# EAGLE design SparkFun_Teensy_Adapter (EAGLE 9.4.2)
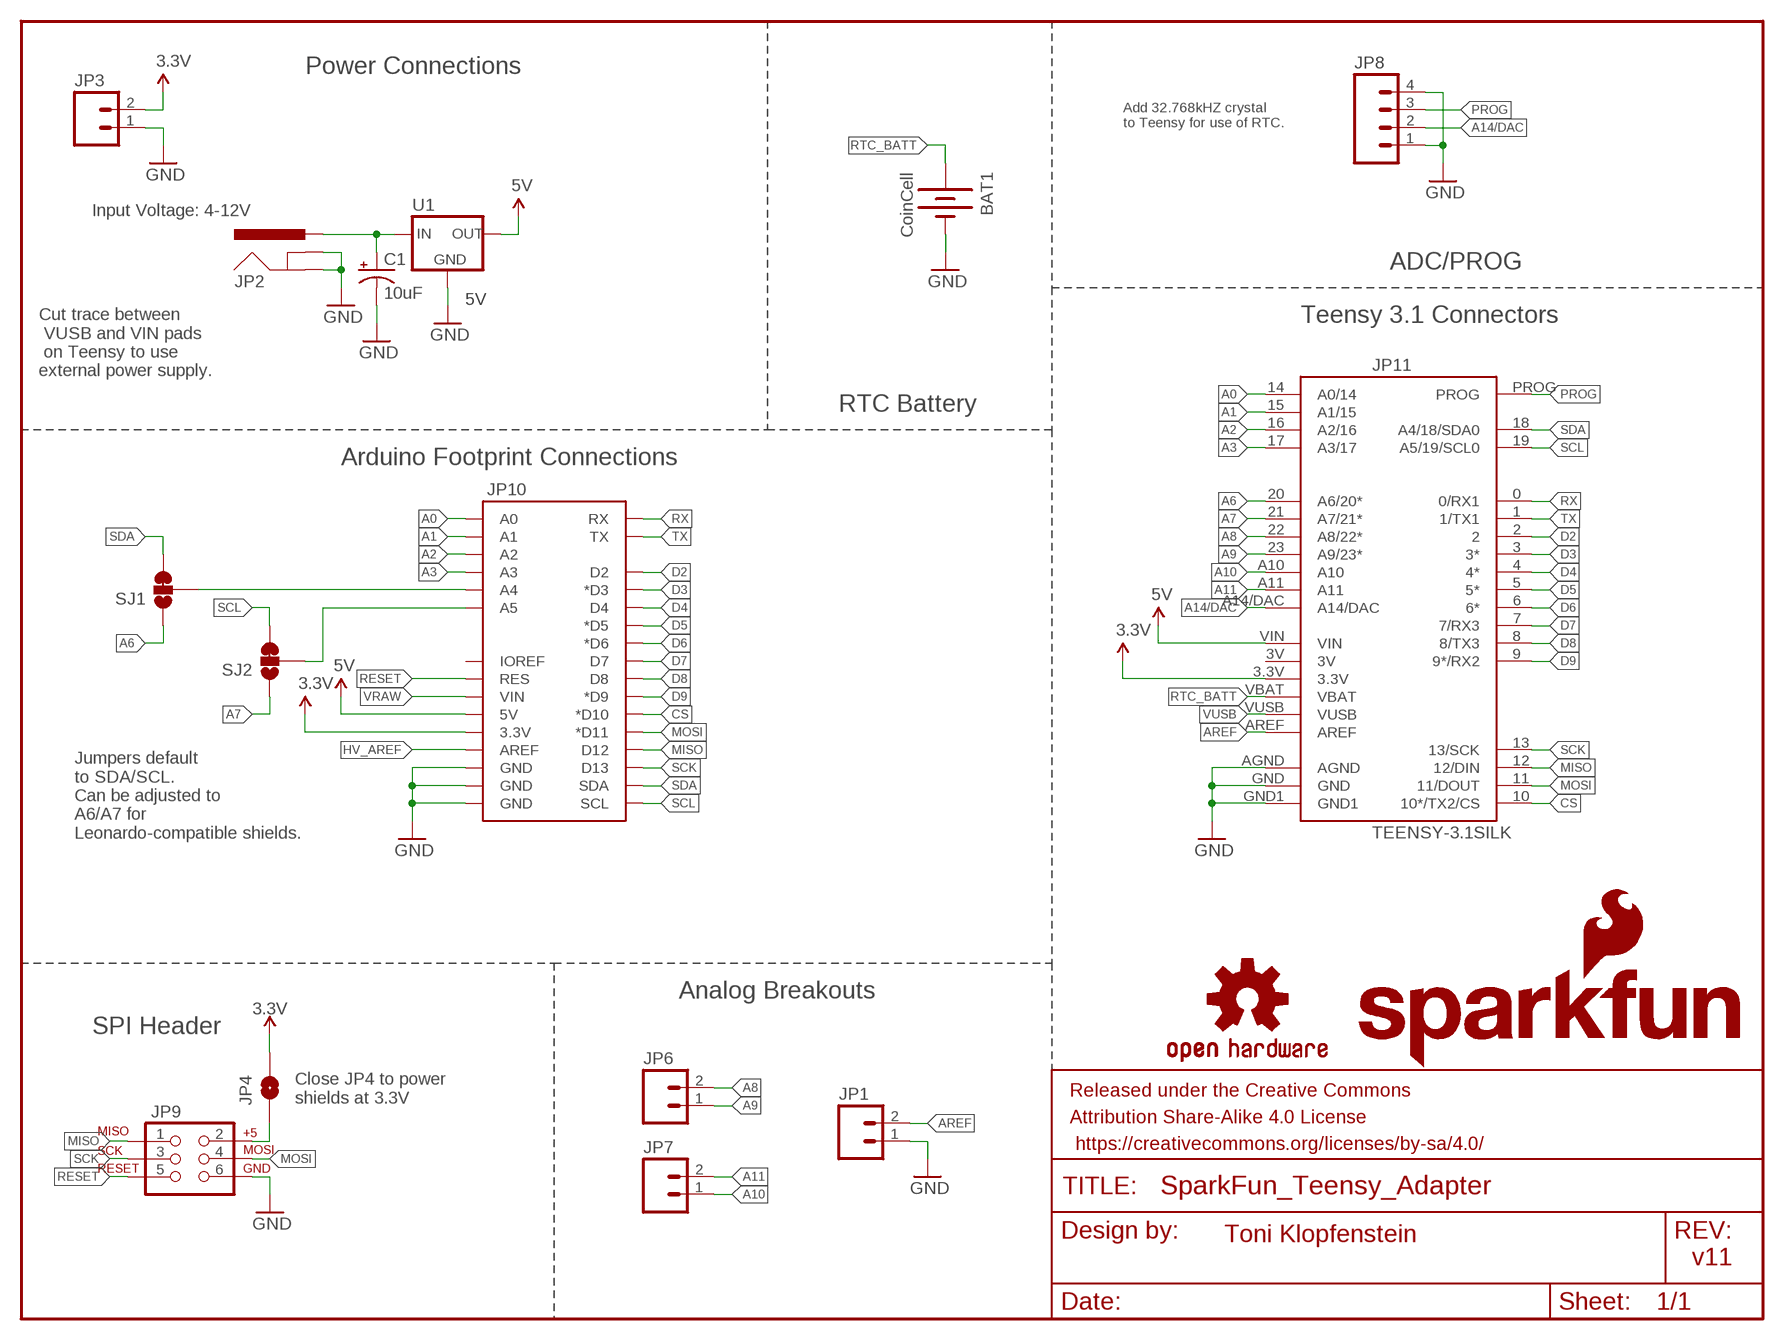
[diagram p0: schematic, sheet 1]

## Parts
BAT1  CoinCell  BATTERY12PTH  [BATTCON_12MM_PTH]
C1  10uF  10UF-25V-20%(PTH)  [CPOL-RADIAL-10UF-25V]
FRAME1  FRAME-LETTER  [CREATIVE_COMMONS]
JP1  M02PTH  [1X02]
JP2  POWER_JACKPTH_LOCK  [POWER_JACK_PTH_LOCK]
JP3  JST2  M02JST-PTH-2  [JST-2-PTH]
JP4  JUMPER-SMT_2_NO_SILK  [SMT-JUMPER_2_NO_SILK]
JP6  M02PTH  [1X02]
JP7  M02PTH  [1X02]
JP8  M04PTH  [1X04]
JP9  AVR_SPI_PRG_6PTH  [2X3]
JP10  ARDUINO_R3_SHIELDUNO_R3_SHIELD_HOLES  [UNO_R3_SHIELD_HOLES]
JP11  TEENSY-3.1SILK  [TEENSY-3.1]
LOGO1  SFE_LOGO_NAME_FLAME.1_INCH  [SFE_LOGO_NAME_FLAME_.1]
LOGO2  OSHW-LOGOM  [OSHW-LOGO-M]
SJ1  JUMPER-PAD-3-2OF3_NC_BY_TRACE_SMALL  [PAD-JUMPER-3-2OF3_NC_BY_TRACE_YES_SILK_FULL_BOX]
SJ2  JUMPER-PAD-3-2OF3_NC_BY_TRACE_SMALL  [PAD-JUMPER-3-2OF3_NC_BY_TRACE_YES_SILK_FULL_BOX]
U1  5V  V_REG_78XX-TO-220  [TO-220-ALT]

## Nets
3.3V: JP3.2 JP4.2 JP10.3.3V JP11.3.3V
5V: JP10.5V JP11.VIN U1.OUT
A0: JP10.A0 JP11.14(A0/14)
A1: JP10.A1 JP11.15(A1/15)
A2: JP10.A2 JP11.16(A2/16)
A3: JP10.A3 JP11.17(A3/17)
A4: JP10.A4 SJ1.2
A5: JP10.A5 SJ2.2
A6: JP11.20(A6/20*) SJ1.1
A7: JP11.21(A7/21*) SJ2.1
A8: JP6.2 JP11.22(A8/22*)
A9: JP6.1 JP11.23(A9/23*)
A10: JP7.1 JP11.A10
A11: JP7.2 JP11.A11
A14/DAC: JP8.2 JP11.A14/DAC
AREF: JP1.2 JP11.AREF
CS: JP10.D10(*D10) JP11.10(10*/TX2/CS)
D2: JP10.D2 JP11.2
D3: JP10.D3(*D3) JP11.3(3*)
D4: JP10.D4 JP11.4(4*)
D5: JP10.D5(*D5) JP11.5(5*)
D6: JP10.D6(*D6) JP11.6(6*)
D7: JP10.D7 JP11.7(7/RX3)
D8: JP10.D8 JP11.8(8/TX3)
D9: JP10.D9(*D9) JP11.9(9*/RX2)
GND: BAT1.GND(-) C1.2(-) JP1.1 JP2.GND JP2.GNDBREAK JP3.1 JP8.1 JP8.4 JP9.6 JP10.GND@0(GND) JP10.GND@1(GND) JP10.GND@2(GND) JP11.AGND JP11.GND JP11.GND1 U1.GND
HV_AREF: JP10.AREF
MISO: JP9.1 JP10.D12 JP11.12(12/DIN)
MOSI: JP9.4 JP10.D11(*D11) JP11.11(11/DOUT)
N$1: JP4.1 JP9.2
PROG: JP8.3 JP11.PROG
RESET: JP9.5 JP10.RES
RTC_BATT: BAT1.VCC@1(+) JP11.VBAT
RX: JP10.RX JP11.0(0/RX1)
SCK: JP9.3 JP10.D13 JP11.13(13/SCK)
SCL: JP10.SCL JP11.19(A5/19/SCL0) SJ2.3
SDA: JP10.SDA JP11.18(A4/18/SDA0) SJ1.3
TX: JP10.TX JP11.1(1/TX1)
VRAW: C1.1(+) JP2.PWR JP10.VIN U1.IN
VUSB: JP11.VUSB
Unconnected: JP10.IOREF JP11.3V

## Notes on the sheet
- Power Connections
- Add 32.768kHZ crystal 
  to Teensy for use of RTC.
- Input Voltage: 4-12V
- ADC/PROG
- Teensy 3.1 Connectors
- Cut trace between
   VUSB and VIN pads
   on Teensy to use 
  external power supply.
- RTC Battery
- Arduino Footprint Connections
- Jumpers default
  to SDA/SCL.
  Can be adjusted to 
  A6/A7 for
  Leonardo-compatible shields.
- Analog Breakouts
- SPI Header
- Close JP4 to power
  shields at 3.3V
- Toni Klopfenstein
- v11

## Library data of the parts
BAT1 = SparkFun-Electromechanical:BATTERY: Battery Holders Various common sizes : AA, AAA, 18650 (PRT-12895), 20mm coin cell and 12mm coin cell. 20MM_4LEGS, BATT-10373; PROD_ID: BATT-08315
C1 = SparkFun-Capacitors:10UF-25V-20%(PTH): CAP-08440; PROD_ID: CAP-08440
FRAME1 = SparkFun-Aesthetics:FRAME-LETTER: Schematic Frame - Letter Standard 8.5x11 US Letter frame
JP1 JP6 JP7 = SparkFun-Connectors:M02: Standard 2-pin 0.1" header. Use with - straight break away headers ( PRT-00116) - right angle break away headers (PRT-00553) - swiss pins (PRT-00743) - machine pins (PRT-00117) - female headers (PRT-00115) Molex polarized connector foot print use with: PRT-08233 with associated crimp pins and housings. 2.54_SCREWTERM for use with PRT-10571. 3.5mm Screw Terminal footprints for PRT-08084 5mm Screw Terminal footprints for use with PRT-08432
JP2 = SparkFun-Connectors:POWER_JACK: Power Jack This is the standard 5.5mm barrel jack for power. The PTH is the most common, proven, reliable, footprint. The Slot footprint only works if the mill layer is transmitted to the PCB fab house so be warned. Mating wall wart : TOL-00298 (and others); PROD_ID: CONN-08197; SF_ID: PRT-00119
JP3 = SparkFun-Connectors:M02: Standard 2-pin 0.1" header. Use with - straight break away headers ( PRT-00116) - right angle break away headers (PRT-00553) - swiss pins (PRT-00743) - machine pins (PRT-00117) - female headers (PRT-00115) Molex polarized connector foot print use with: PRT-08233 with associated crimp pins and housings. 2.54_SCREWTERM for use with PRT-10571. 3.5mm Screw Terminal footprints for PRT-08084 5mm Screw Terminal footprints for use with PRT-08432; PROD_ID: CONN-09863; SKU: PRT-09914
JP4 = SparkFun-Jumpers:JUMPER-SMT_2_NO: Normally open jumper This jumper has two pads in close proximity to each other. Apply solder to close the connection. Round pads are easier to solder for beginners, but are a lot larger. SparkFun Product that uses the round pads: SparkFun EL Sequencer <https://www.sparkfun.com/products/12781>
JP8 = SparkFun-Connectors:M04: Header 4 Standard 4-pin 0.1" header. Use with straight break away headers (SKU : PRT-00116), right angle break away headers (PRT-00553), swiss pins (PRT-00743), machine pins (PRT-00117), and female headers (PRT-00115). Molex polarized connector foot print use with SKU : PRT-08231 with associated crimp pins and housings. 1MM SMD Version SKU: PRT-10208
JP9 = SparkFun-Connectors:AVR_SPI_PRG_6: AVR ISP 6 Pin This is the reduced ISP connector for AVR programming. Common on Arduino. This footprint will take up less PCB space and can be used with a 10-pin to 6-pin adapter such as SKU: BOB-08508 **Special note about "TEST_POINT" package. The stop mask is on the top side, so if you want your programming test points to be on the bottom of your board, make sure to place this package on the bottom side of the board. This also ensure that the orientation to program from the bottom side will be correct.
JP10 = Testing:ARDUINO_R3_SHIELD: Shield form compatible with the Arduino Uno R3.
JP11 = Testing:TEENSY-3.1; SF_ID: DEV-12646
LOGO1 = SparkFun-Aesthetics:SFE_LOGO_NAME_FLAME: SFE Logo, name and flame This is the SparkFun full logo. The logo on the schematic will always be the same size; the package variant is the height of the flame part of the logo. Default layer for the logo on the board is tSilk.
LOGO2 = SparkFun-Aesthetics:OSHW-LOGO: Open Source Hardware Logo This logo indicates the piece of hardware it is found on incorporates a OSHW license and/or adheres to the definition of open source hardware found here: http://freedomdefined.org/OSHW
SJ1 SJ2 = SparkFun-Passives:JUMPER-PAD-3-2OF3_NC_BY_TRACE
U1 = SparkFun-PowerIC:V_REG_78XX: Voltage Regulator Standard 78xx regulator. IGO (Input Ground Output). Spark Fun Electronics SKU : COM-00107; PROD_ID: VREG-08450; SF_ID: COM-00107

## Board
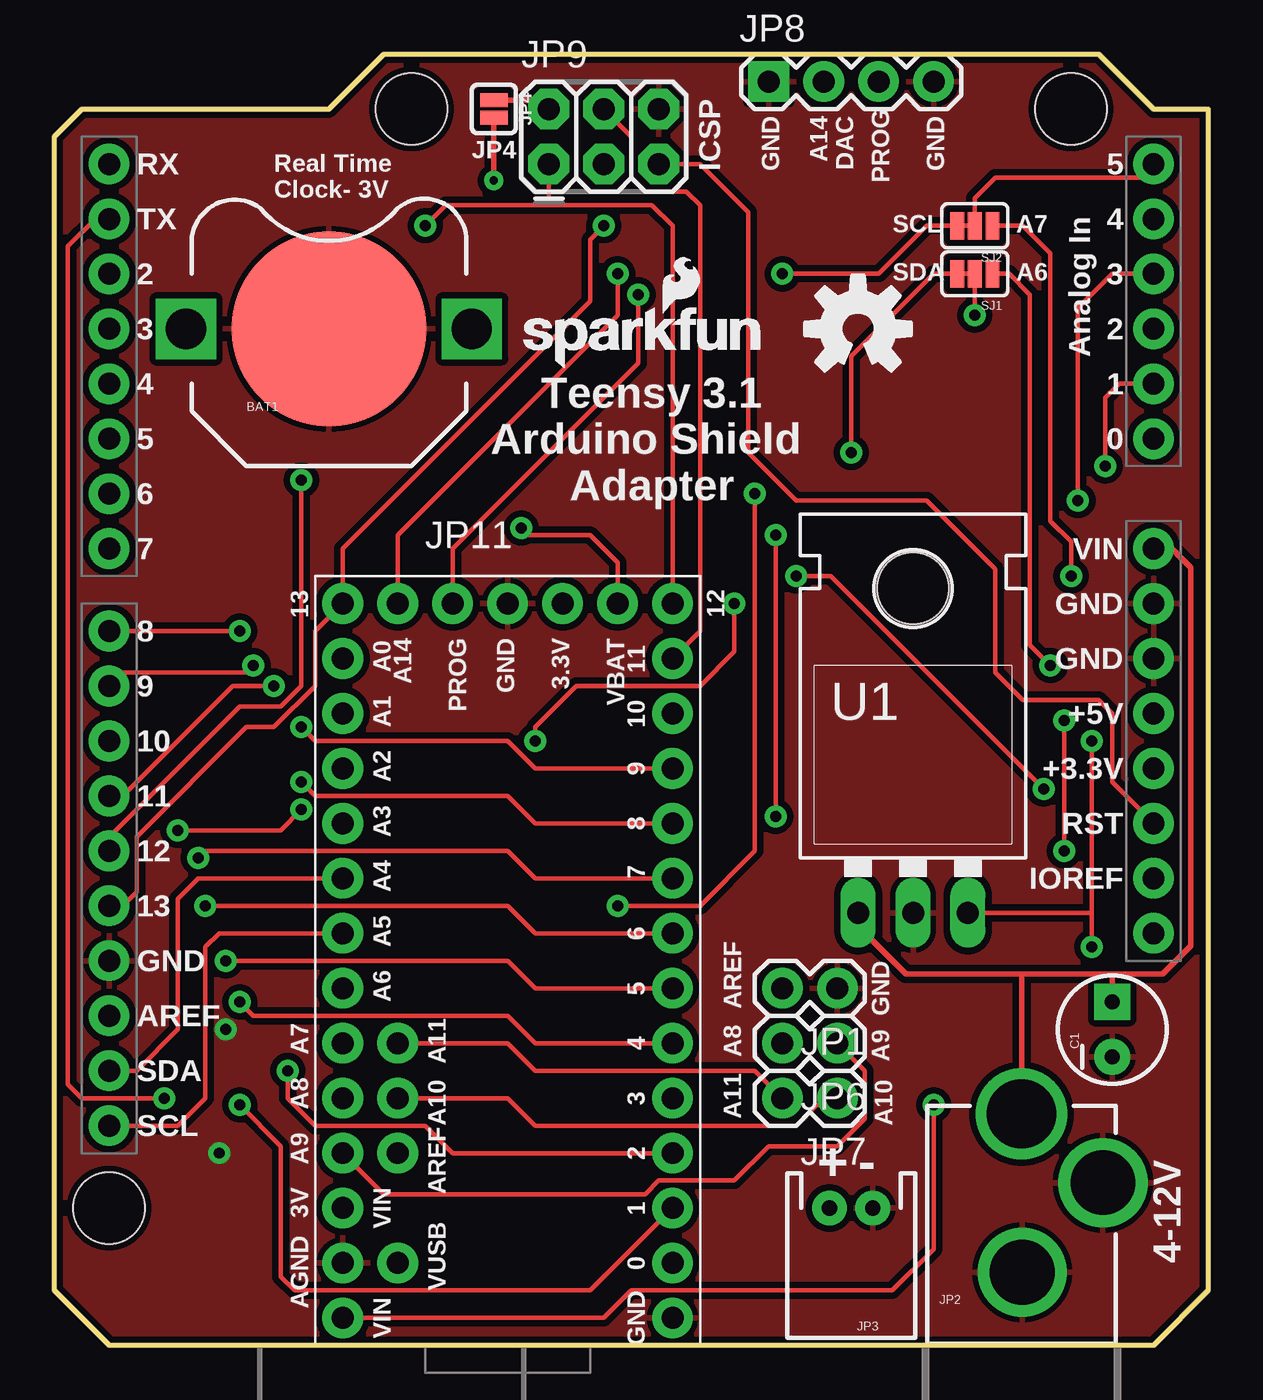
[diagram p1: board, top side]
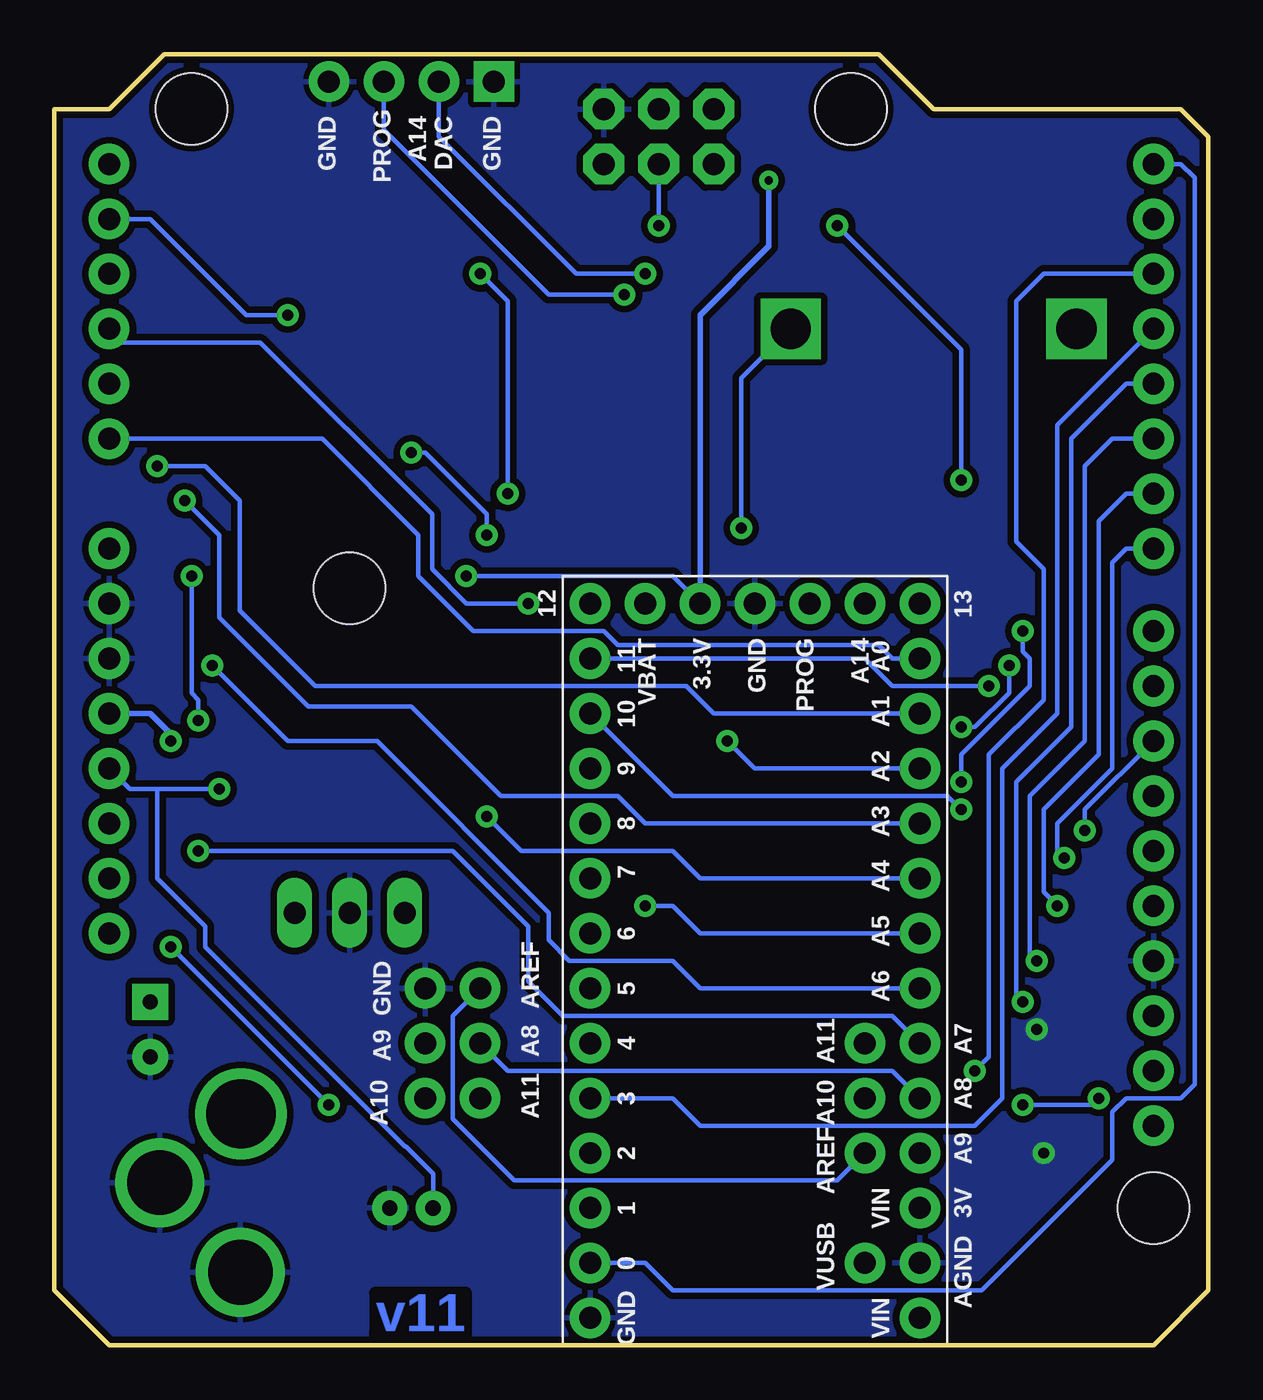
[diagram p2: board, bottom side, seen from below]

Size 53.34 x 59.69 mm. Coordinates in mm from the lower left corner, seen from the top.
Outline: 0,2.54 2.54,0 50.8,0 53.34,2.54 53.34,57.15 50.8,57.15 48.26,59.69 15.24,59.69 12.7,57.15 1.27,57.15 0,55.88 0,2.54
Copper layers (1*16): Top 0.035mm / dielectric 1.5mm / Bottom 0.035mm
Design rules "SparkFun-2-layer": minimum track width 7mil, minimum drill 15mil, track to track 8mil, track to pad 8mil, pad to pad 8mil, via to via 8mil, smd to smd 8mil, copper to edge 8mil, drill to drill 8mil, minimum pad ring 12mil, minimum via ring 10mil, stop-mask expansion 4mil, vias tented up to drill 20mil, thermal gap 10mil

### Footprints (pad centres in the part's own frame; a part is rotated, then mirrored left to right if it is on the bottom)
BATTCON_12MM_PTH = smd 9 x 9: GND 0,0 | drill 1.854 square: VCC@1 6.604,0; VCC@2 -6.604,0
CPOL-RADIAL-10UF-25V = drill 0.7 pad 1.651 square: 1 1.27,0 | drill 0.7 pad 1.651: 2 -1.27,0
1X02 = drill 1.016 pad 1.88: 1 0,0; 2 2.54,0
POWER_JACK_PTH_LOCK = drill 2.997 pad 4.115: GND 0.025,6.557; GNDBREAK 3.762,10.7 | drill 3.2 pad 4.115: PWR 0,13.878
JST-2-PTH = drill 0.7 pad 1.6: 1 -1,0; 2 1,0
SMT-JUMPER_2_NO_SILK = smd 0.635 x 1.27: 1 -0.406,0; 2 0.406,0
1X04 = drill 1.016 pad 1.88 square: 1 0,0 | drill 1.016 pad 1.88: 2 2.54,0; 3 5.08,0; 4 7.62,0
2X3 = drill 1.016 pad 1.88 octagon: 1 0,0; 2 0,2.54; 3 2.54,0; 4 2.54,2.54; 5 5.08,0; 6 5.08,2.54
UNO_R3_SHIELD_HOLES = drill 1.016 pad 1.88: 3.3V 50.8,26.67; 5V 50.8,29.21; A0 50.8,41.91; A1 50.8,44.45; A2 50.8,46.99; A3 50.8,49.53; A4 50.8,52.07; A5 50.8,54.61; AREF 2.54,15.24; D2 2.54,49.53; D3 2.54,46.99; D4 2.54,44.45; D5 2.54,41.91; D6 2.54,39.37; D7 2.54,36.83; D8 2.54,33.02; D9 2.54,30.48; D10 2.54,27.94; D11 2.54,25.4; D12 2.54,22.86; D13 2.54,20.32; GND@0 50.8,31.75; GND@1 50.8,34.29; GND@2 2.54,17.78; IOREF 50.8,21.59; NC 50.8,19.05; RES 50.8,24.13; RX 2.54,54.61; SCL 2.54,10.16; SDA 2.54,12.7; TX 2.54,52.07; VIN 50.8,36.83 | hole 3.302: 2.54,6.35; 46.99,57.15; 16.51,57.15
TEENSY-3.1 = drill 1.016 pad 1.88: 0 16.51,3.81; 1 16.51,6.35; 2 16.51,8.89; 3 16.51,11.43; 3.3V 11.43,34.29; 3V 1.27,6.35; 4 16.51,13.97; 5 16.51,16.51; 6 16.51,19.05; 7 16.51,21.59; 8 16.51,24.13; 9 16.51,26.67; 10 16.51,29.21; 11 16.51,31.75; 12 16.51,34.29; 13 1.27,34.29; 14 1.27,31.75; 15 1.27,29.21; 16 1.27,26.67; 17 1.27,24.13; 18 1.27,21.59; 19 1.27,19.05; 20 1.27,16.51; 21 1.27,13.97; 22 1.27,11.43; 23 1.27,8.89; A10 3.81,11.43; A11 3.81,13.97; A14/DAC 3.81,34.29; AGND 1.27,3.81; AREF 3.81,8.89; GND 8.89,34.29; GND1 16.51,1.27; PROG 6.35,34.29; VBAT 13.97,34.29; VIN 1.27,1.27; VUSB 3.81,3.81
PAD-JUMPER-3-2OF3_NC_BY_TRACE_YES_SILK_FULL_BOX = smd 0.635 x 1.27: 1 -0.813,0; 2 0,0; 3 0.813,0
TO-220-ALT = drill 1.016 long: GND 0,-3.81; IN -2.54,-3.81; OUT 2.54,-3.81 | hole 3.302: 0,11.176

### Placement (x,y rotation side)
BAT1  12.7,46.99 0 top
C1  48.9,14.6 90 top
FRAME1  16.51,-26.67 0 top  (outside the outline)
JP1  36.2,16.51 180 top
JP2  44.7,-3.18 0 top
JP3  36.83,6.35 180 top
JP4  20.32,57.15 270 top
JP6  36.2,13.97 180 top
JP7  36.2,11.43 180 top
JP8  33.02,58.42 0 top
JP9  22.86,54.61 0 top
JP10  0,0 0 top
JP11  12.07,0 0 top
LOGO1  21.27,45.08 0 top
LOGO2  37.15,46.99 0 top
SJ1  42.55,49.53 180 top
SJ2  42.55,51.75 180 top
U1  39.69,23.81 0 top

### Tracks (layer width: path | path; a pad name or v marks a point on that pad's centre or on a via)
3.3V  (via drill 0.38, 0.51)
  Top 0.203: v34.29,35.56 35.88,35.56 v45.72,25.72
  Top 0.254: v20.32,53.85 JP4.2
  Bottom 0.203: JP3.2 35.83,7.94 37.1,9.21 37.15,9.21 46.36,18.41 46.36,19.37 48.58,21.59 48.58,25.72 | JP11.3.3V 24.77,35.56 v34.29,35.56 | v45.72,25.72 48.58,25.72 | 48.58,25.72 49.85,25.72 JP10.3.3V
  Bottom 0.254: JP11.3.3V 23.5,47.62 20.32,50.8 v20.32,53.85
5V  (via drill 0.51)
  Top 0.203: JP11.VIN 25.4,1.27 26.67,2.54 38.73,2.54 40.64,4.44 v40.64,11.11 | 47.94,20 v47.94,27.94 | U1.OUT 47.94,20 | v47.94,18.41 47.94,20
  Bottom 0.203: v40.64,11.11 v47.94,18.41
  Bottom 0.254: v47.94,27.94 47.94,28.26 48.9,29.21 JP10.5V
A0
  Bottom 0.203: JP11.14 14.61,31.75 15.24,32.39 27.3,32.39 27.94,33.02 33.97,33.02 36.51,35.56 36.51,37.47 40.96,41.91 JP10.A0
A1  (via drill 0.51)
  Top 0.203: v48.58,40.64 48.58,43.81 49.21,44.45 JP10.A1
  Bottom 0.203: JP11.15 22.86,29.21 24.13,30.48 41.27,30.48 44.77,33.97 44.77,39.05 46.36,40.64 v48.58,40.64
A2  (via drill 0.51)
  Top 0.203: v22.23,27.94 22.23,28.57 24.13,30.48 29.84,30.48 31.43,32.07 v31.43,34.29
  Bottom 0.203: JP11.16 20.96,26.67 v22.23,27.94 | v31.43,34.29 34.29,34.29 35.88,35.88 35.88,38.42 43.81,46.36 50.16,46.36 JP10.A2
A3  (via drill 0.51)
  Top 0.203: JP10.A3 48.9,49.53 47.31,47.94 v47.31,39.05
  Bottom 0.203: JP11.17 26.04,24.13 27.3,25.4 32.7,25.4 36.83,29.53 41.59,29.53 45.72,33.66 45.72,37.47 v47.31,39.05
A4  (via drill 0.51)
  Top 0.203: SJ1.2 v42.55,47.62
  Bottom 0.203: JP10.A4 48.9,52.07 44.45,47.62 v42.55,47.62
A5
  Top 0.203: SJ2.2 42.55,53.02 43.5,53.97 50.16,53.97 JP10.A5
A6  (via drill 0.51)
  Top 0.203: SJ1.1 44.13,49.53 45.09,48.58 45.09,32.39 v46.04,31.43
  Bottom 0.203: JP11.20 23.5,16.51 24.77,17.78 29.53,17.78 30.48,18.73 30.48,20 38.42,27.94 42.55,27.94 v46.04,31.43
A7  (via drill 0.51)
  Top 0.203: SJ2.1 44.77,51.75 46.04,50.48 46.04,38.1 46.99,37.15 v46.99,35.56 | v46.67,22.86 v46.67,28.89
  Bottom 0.203: JP11.21 14.61,15.24 29.84,15.24 31.43,16.83 31.43,19.37 34.93,22.86 v46.67,22.86 | v46.99,35.56 46.99,30.16 46.67,29.84 v46.67,28.89
A8
  Bottom 0.203: JP11.22 14.61,12.7 32.38,12.7 JP6.2
A9
  Top 0.203: JP11.23 15.24,6.98 27.3,6.98 27.94,7.62 31.43,7.62 33.02,9.21 36.2,9.21 37.47,10.48 37.47,12.7 JP6.1
A10
  Top 0.203: JP11.A10 20.96,11.43 22.23,10.16 34.29,10.16 35.24,11.11 35.88,11.11 JP7.1
A11
  Top 0.203: JP11.A11 20.96,13.97 22.23,12.7 32.38,12.7 JP7.2
A14/DAC  (via drill 0.51)
  Top 0.203: JP11.A14/DAC 15.88,37.47 26.04,47.62 v26.04,49.53
  Bottom 0.203: v26.04,49.53 29.21,49.53 35.56,55.88 JP8.2
AREF
  Bottom 0.203: JP1.2 34.93,15.24 34.93,10.48 32.07,7.62 17.14,7.62 JP11.AREF
CS  (via drill 0.51)
  Top 0.203: v5.72,23.81 10.48,23.81 v11.43,24.76
  Bottom 0.203: v11.43,24.76 12.07,25.4 24.77,25.4 JP11.10 | JP10.D10 5.72,24.76 v5.72,23.81
D2  (via drill 0.51)
  Top 0.203: JP11.2 18.41,8.89 17.14,10.16 12.07,10.16 10.8,11.43 v10.8,12.7
  Bottom 0.203: v10.8,12.7 10.16,13.33 10.16,27.3 7.62,29.84 7.62,35.88 8.89,37.15 8.89,48.26 7.62,49.53 JP10.D2
D3
  Bottom 0.203: JP11.3 24.77,11.43 23.5,10.16 10.8,10.16 9.52,11.43 9.52,26.67 6.99,29.21 6.99,42.55 JP10.D3
D4  (via drill 0.51)
  Top 0.203: JP11.4 22.23,13.97 20.96,15.24 9.21,15.24 v8.57,15.87
  Bottom 0.203: JP10.D4 3.81,44.45 6.35,41.91 6.35,28.57 8.89,26.04 8.89,16.19 v8.57,15.87
D5  (via drill 0.51)
  Top 0.203: JP11.5 22.23,16.51 20.96,17.78 v7.94,17.78
  Bottom 0.203: JP10.D5 4.45,41.91 5.72,40.64 5.72,27.94 8.25,25.4 8.25,18.1 v7.94,17.78
D6  (via drill 0.51)
  Top 0.203: JP11.6 22.23,19.05 20.96,20.32 v6.99,20.32
  Bottom 0.203: JP10.D6 3.81,39.37 5.08,38.1 5.08,27.3 7.62,24.76 7.62,20.96 v6.99,20.32
D7  (via drill 0.51)
  Top 0.203: JP11.7 22.23,21.59 20.96,22.86 6.99,22.86 v6.67,22.54
  Bottom 0.203: JP10.D7 3.81,36.83 4.45,36.19 4.45,26.67 6.99,24.13 6.99,22.86 v6.67,22.54
D8  (via drill 0.51)
  Top 0.203: JP11.8 22.23,24.13 20.96,25.4 12.07,25.4 v11.43,26.04 | v8.57,33.02 JP10.D8
  Bottom 0.203: v11.43,26.04 11.43,27.3 8.25,30.48 8.25,31.75 8.57,32.07 v8.57,33.02
D9  (via drill 0.51)
  Top 0.203: JP11.9 22.23,26.67 20.96,27.94 12.07,27.94 v11.43,28.57 | JP10.D9 3.17,31.11 8.89,31.11 v9.21,31.43
  Bottom 0.203: v11.43,28.57 10.8,28.57 9.21,30.16 v9.21,31.43
GND  (via drill 0.51)
  other vias: 7.62,8.89 7.94,14.6
  pour Bottom (isolate 0.305): 0,55.88 1.27,57.15 12.7,57.15 15.24,59.69 48.26,59.69 50.8,57.15 53.34,57.15 53.34,2.54 50.8,0 2.54,0 0,2.54
  pour Top (isolate 0.305): 1.27,57.15 12.7,57.15 15.24,59.69 48.26,59.69 50.8,57.15 53.34,57.15 53.34,2.54 50.8,0 2.54,0 0,2.54 0,55.88
MISO  (via drill 0.51)
  Top 0.203: JP11.12 28.57,51.75 27.62,52.7 22.86,52.7 | JP10.D12 2.54,23.5 8.57,29.53 10.48,29.53 11.43,30.48 v11.43,40 | 22.86,53.97 JP9.1 22.86,52.7 | v17.14,51.75 18.1,52.7 22.86,52.7
  Bottom 0.203: v11.43,40 11.43,46.04 v17.14,51.75
MOSI  (via drill 0.51)
  Top 0.203: JP9.4 26.67,55.88 26.67,53.97 27.3,53.34 29.21,53.34 29.84,52.7 29.84,33.02 JP11.11 | JP10.D11 3.17,25.4 8.25,30.48 v10.16,30.48
  Bottom 0.203: JP11.11 15.88,31.75 14.61,30.48 v10.16,30.48
N$1
  Top 0.254: JP4.1 22.45,57.56 JP9.2
PROG  (via drill 0.51)
  Top 0.203: JP11.PROG 18.41,36.83 26.99,45.4 v26.99,48.58
  Bottom 0.203: v26.99,48.58 30.48,48.58 38.1,56.2 JP8.3
RESET
  Top 0.203: JP9.5 29.84,54.61 32.07,52.39 32.07,41.27 34.29,39.05 40.32,39.05 43.5,35.88 43.5,31.11 44.77,29.84 48.26,29.84 48.9,29.21 48.9,26.04 JP10.RES
RTC_BATT  (via drill 0.51)
  Top 0.203: JP11.VBAT 26.04,36.19 24.77,37.47 21.91,37.47 v21.59,37.78
  Bottom 0.203: v21.59,37.78 21.59,44.7 BAT1.VCC@1
RX
  Bottom 0.203: JP11.0 26.04,3.81 24.77,2.54 10.48,2.54 4.45,8.57 4.45,10.79 3.81,11.43 1.27,11.43 0.63,12.06 0.63,53.97 1.27,54.61 JP10.RX
SCK  (via drill 0.51)
  Top 0.203: JP10.D13 3.17,20.32 3.81,20.96 3.81,23.5 8.89,28.57 10.16,28.57 12.07,30.48 12.07,33.02 JP11.13 13.34,36.83 24.77,48.26 24.77,51.12 v25.4,51.75
  Bottom 0.203: v25.4,51.75 JP9.3
SCL  (via drill 0.51)
  Top 0.203: JP11.19 7.62,19.05 6.99,18.41 6.99,11.43 5.72,10.16 JP10.SCL | v32.38,39.37 32.38,22.86 29.84,20.32 v26.04,20.32 | v33.66,49.53 38.1,49.53 40.32,51.75 SJ2.3
  Bottom 0.203: v26.04,20.32 24.77,20.32 23.5,19.05 JP11.19 | v32.38,39.37 32.38,48.26 v33.66,49.53
SDA  (via drill 0.51)
  Top 0.203: JP11.18 6.67,21.59 5.72,20.64 5.72,14.6 3.81,12.7 JP10.SDA | v33.34,24.45 v33.34,37.47 | v36.83,41.27 36.83,45.72 40.64,49.53 SJ1.3
  Bottom 0.203: JP11.18 23.5,21.59 24.77,22.86 31.75,22.86 v33.34,24.45 | v33.34,37.47 33.34,38.42 36.2,41.27 v36.83,41.27
TX  (via drill 0.51)
  Top 0.203: JP10.TX 1.91,52.07 0.63,50.8 0.63,12.06 1.27,11.43 v5.08,11.43 | JP11.1 24.77,2.54 11.11,2.54 10.48,3.17 10.48,9.21 v8.57,11.11
  Bottom 0.203: v8.57,11.11 5.4,11.11 v5.08,11.43
VRAW
  Top 0.254: JP10.VIN 51.64,36.83 52.51,35.95 52.51,18.47 51.22,17.17 48.9,17.17 | 48.9,17.17 44.77,17.17 | C1.1 48.9,17.17 | JP2.PWR 44.7,17.11 44.77,17.17 | 44.77,17.17 39.34,17.17 37.15,19.37 U1.IN

### Text on the board
Bottom: v11
tPlace: PROG | GND | A14 / DAC | GND | JP4 | ICSP | Real Time / Clock- 3V | SCL | A7 | SDA | A6 | Teensy 3.1 / Arduino Shield / Adapter | GND | AREF | A9 | A8 | A11 | A10 | + | - | 4-12V
bPlace: PROG | GND | A14 / DAC | GND | GND | AREF | A9 | A8 | A11 | A10
tDocu: Toni Klopfenstein